# Altium schematic sheet Connectors.SchDoc
size A
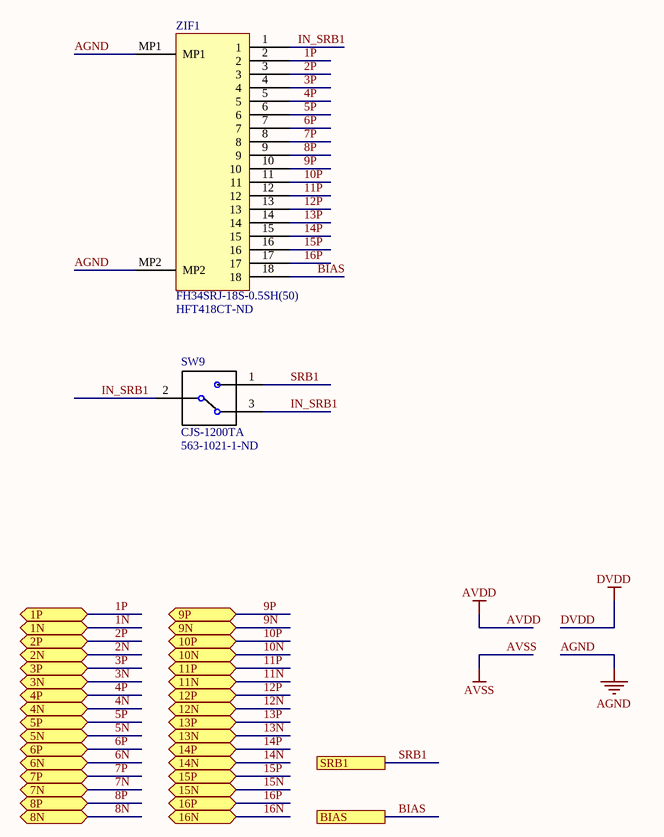
[diagram p0: Connectors.SchDoc]

## Parts
SW9  CJS-1200TA  Supplier Part Number 1: 563-1021-1-ND  [*SW_CJS-1200TA]
ZIF1  FH34SRJ-18S-0.5SH(50)  Supplier Part Number 1: HFT418CT-ND  [ZIF_18S]

## Ports
1N (bidir), 1P (bidir), 2N (bidir), 2P (bidir), 3N (bidir), 3P (bidir), 4N (bidir), 4P (bidir), 5N (bidir), 5P (bidir), 6N (bidir), 6P (bidir), 7N (bidir), 7P (bidir), 8N (bidir), 8P (bidir), 9N (bidir), 9P (bidir), 10N (bidir), 10P (bidir), 11N (bidir), 11P (bidir), 12N (bidir), 12P (bidir), 13N (bidir), 13P (bidir), 14N (bidir), 14P (bidir), 15N (bidir), 15P (bidir), 16N (bidir), 16P (bidir), BIAS, SRB1

## Nets
AGND: ZIF1.MP1 ZIF1.MP2
1N: port 1N
1P: ZIF1.2 ; port 1P
2N: port 2N
2P: ZIF1.3 ; port 2P
3N: port 3N
3P: ZIF1.4 ; port 3P
4N: port 4N
4P: ZIF1.5 ; port 4P
5N: port 5N
5P: ZIF1.6 ; port 5P
6N: port 6N
6P: ZIF1.7 ; port 6P
7N: port 7N
7P: ZIF1.8 ; port 7P
8N: port 8N
8P: ZIF1.9 ; port 8P
9N: port 9N
9P: ZIF1.10 ; port 9P
10N: port 10N
10P: ZIF1.11 ; port 10P
11N: port 11N
11P: ZIF1.12 ; port 11P
12N: port 12N
12P: ZIF1.13 ; port 12P
13N: port 13N
13P: ZIF1.14 ; port 13P
14N: port 14N
14P: ZIF1.15 ; port 14P
15N: port 15N
15P: ZIF1.16 ; port 15P
16N: port 16N
16P: ZIF1.17 ; port 16P
BIAS: ZIF1.18 ; port BIAS
IN_SRB1: SW9.2 SW9.3 ZIF1.1
SRB1: SW9.1 ; port SRB1

## Library data of the parts
SW9 = CJS-1200TA: SWITCH SLIDE SPDT 100MA 6V; Manufacturer 1: Nidec Copal; Body Material: Polyphenylene; Number of Positions: 2; Electrical Life: 200Cycles; Max Voltage Rating (DC): 24V; Actuator Type: Slide (Standard); Washable: Yes; Supplier 1: Digi-Key; Manufacturer Part Number 1: CJS-1200TA; Stock 1: 72766; Pricing 1: 1=0.88000, 10=0.86000, 25=0.81000, 50=0.76040, 100=0.72730, 250=0.69428, 500=0.62814 (USD); RoHS: Yes; Mount: Surface Mount; Contact Material: Copper Alloy; Contact Plating: Gold; Min Operating Temperature: -40°C; Max Operating Temperature: 85°C; Packaging: Tape and Reel; Throw Configuration: SPDT; Voltage Rating (DC): 6V; Current Rating: 100mA; Termination: J-Hook; Orientation: Vertical; Length: 0.212inch; Radiation Hardening: No; Lead Free: Lead Free; ComponentLink1URL: https://datasheet.ciiva.com/2864/cjs-2864476.pdf?src-supplier=Digi-Key; ComponentLink1Description: https://datasheet.ciiva.com/2864/cjs-2864476.pdf?src-supplier=Digi-Key; ComponentLink2URL: https://datasheet.ciiva.com/2864/cjs-2864477.pdf?src-supplier=Digi-Key; ComponentLink2Description: https://datasheet.ciiva.com/2864/cjs-2864477.pdf?src-supplier=Digi-Key; ComponentLink3URL: https://datasheet.ciiva.com/2864/cjs-2864478.pdf?src-supplier=Digi-Key; ComponentLink3Description: https://datasheet.ciiva.com/2864/cjs-2864478.pdf?src-supplier=Digi-Key
ZIF1 = FH34SRJ-18S-0.5SH(50): CONN FFC FPC 18POS 0.50MM R/A; Manufacturer 1: Hirose; Actuator Material: Nylon,Polyamide; Current Rating: 500mA; Voltage Rating: 50V; Number of Positions: 18; Wire/Cable Type: Flat Flex; Insulation Resistance: 500MR; Gender: Receptacle; Pitch: 0.02inch; Supplier 1: Digi-Key; Manufacturer Part Number 1: FH34SRJ-18S-0.5SH(50); Stock 1: 1441; Pricing 1: 1=2.17000, 10=1.96700, 25=1.84680, 50=1.76660, 100=1.68630, 250=1.52572, 500=1.40526 (USD); RoHS: Yes; Mount: Surface Mount; Contact Plating: Gold; Contact Material: Bronze; Housing Material: Polymer; Min Operating Temperature: -55°C; Max Operating Temperature: 85°C; Package Quantity: 5000; Packaging: Tape and Reel; Termination: SMD/SMT; Number of Rows: 1; Number of Contacts: 18; Flammability Rating: UL94 V-0; REACH SVHC: No SVHC; ComponentLink1URL: https://datasheet.ciiva.com/46408/1693466-46408165.pdf?src-supplier=Element14; ComponentLink1Description: https://datasheet.ciiva.com/46408/1693466-46408165.pdf?src-supplier=Element14